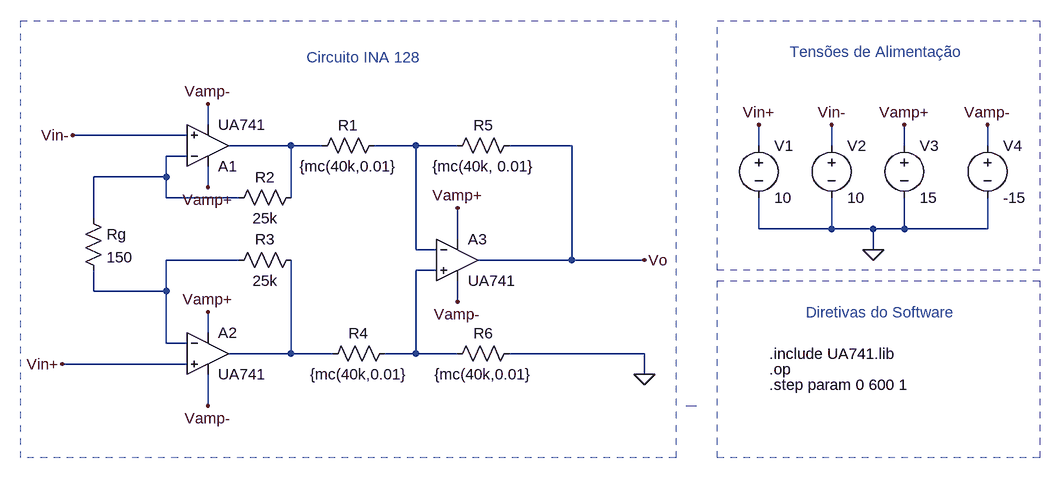
[diagram p0: schematic Trabalho1_Simu_2B001.asc]
Trabalho1_Simu_2B001.asc, the LTspice schematic file:
Version 4
SHEET 1 1748 680
WIRE -224 -176 -224 -208
WIRE -256 -160 -432 -160
WIRE -96 -144 -192 -144
WIRE -48 -144 -96 -144
WIRE 96 -144 32 -144
WIRE 160 -144 96 -144
WIRE 336 -144 240 -144
WIRE 624 -144 624 -176
WIRE 736 -144 736 -176
WIRE 848 -144 848 -176
WIRE 976 -144 976 -176
WIRE -256 -128 -288 -128
WIRE -288 -96 -288 -128
WIRE -288 -96 -400 -96
WIRE -224 -80 -224 -112
WIRE -288 -64 -288 -96
WIRE -176 -64 -288 -64
WIRE -96 -64 -96 -144
WIRE -400 -32 -400 -96
WIRE 624 -16 624 -64
WIRE 736 -16 736 -64
WIRE 736 -16 624 -16
WIRE 800 -16 736 -16
WIRE 848 -16 848 -64
WIRE 848 -16 800 -16
WIRE 976 -16 976 -64
WIRE 976 -16 848 -16
WIRE 160 0 160 -48
WIRE 96 16 96 -144
WIRE 128 16 96 16
WIRE 800 16 800 -16
WIRE -176 32 -288 32
WIRE 336 32 336 -144
WIRE 336 32 192 32
WIRE 448 32 336 32
WIRE 128 48 96 48
WIRE -400 80 -400 48
WIRE -288 80 -288 32
WIRE -288 80 -400 80
WIRE 160 96 160 64
WIRE -224 144 -224 112
WIRE -288 160 -288 80
WIRE -256 160 -288 160
WIRE -96 176 -96 32
WIRE -96 176 -192 176
WIRE -32 176 -96 176
WIRE 96 176 96 48
WIRE 96 176 48 176
WIRE 160 176 96 176
WIRE 448 176 240 176
WIRE -256 192 -448 192
WIRE 448 208 448 176
WIRE -224 256 -224 208
FLAG 448 32 Vo
FLAG 624 -176 Vin+
FLAG 736 -176 Vin-
FLAG 848 -176 Vamp+
FLAG 976 -176 Vamp-
FLAG 800 16 0
FLAG -448 192 Vin+
FLAG -432 -160 Vin-
FLAG 448 208 0
FLAG 160 -48 Vamp+
FLAG -224 -80 Vamp+
FLAG -224 112 Vamp+
FLAG -224 -208 Vamp-
FLAG 160 96 Vamp-
FLAG -224 256 Vamp-
SYMBOL res 48 -160 R90
WINDOW 0 0 56 VBottom 2
WINDOW 3 32 56 VTop 2
SYMATTR InstName R1
SYMATTR Value {mc(40k,0.01}
SYMBOL res -80 -80 R90
WINDOW 0 0 56 VBottom 2
WINDOW 3 32 56 VTop 2
SYMATTR InstName R2
SYMATTR Value 25k
SYMBOL res -80 16 R90
WINDOW 0 0 56 VBottom 2
WINDOW 3 32 56 VTop 2
SYMATTR InstName R3
SYMATTR Value 25k
SYMBOL res 64 160 R90
WINDOW 0 0 56 VBottom 2
WINDOW 3 32 56 VTop 2
SYMATTR InstName R4
SYMATTR Value {mc(40k,0.01}
SYMBOL res 256 -160 R90
WINDOW 0 0 56 VBottom 2
WINDOW 3 32 56 VTop 2
SYMATTR InstName R5
SYMATTR Value {mc(40k, 0.01}
SYMBOL res 256 160 R90
WINDOW 0 0 56 VBottom 2
WINDOW 3 32 56 VTop 2
SYMATTR InstName R6
SYMATTR Value {mc(40k,0.01}
SYMBOL res -416 -48 R0
SYMATTR InstName Rg
SYMATTR Value 150
SYMBOL OpAmps\\opamp2 -224 112 R0
SYMATTR InstName A2
SYMATTR Value UA741
SYMBOL OpAmps\\opamp2 160 -32 R0
SYMATTR InstName A3
SYMATTR Value UA741
SYMBOL OpAmps\\opamp2 -224 -80 M180
SYMATTR InstName A1
SYMATTR Value UA741
SYMBOL voltage 624 -160 R0
WINDOW 123 0 0 Left 0
WINDOW 39 0 0 Left 0
SYMATTR InstName V1
SYMATTR Value 10
SYMBOL voltage 736 -160 R0
WINDOW 123 0 0 Left 0
WINDOW 39 0 0 Left 0
SYMATTR InstName V2
SYMATTR Value 10
SYMBOL voltage 848 -160 R0
WINDOW 123 0 0 Left 0
WINDOW 39 0 0 Left 0
SYMATTR InstName V3
SYMATTR Value 15
SYMBOL voltage 976 -160 R0
WINDOW 123 0 0 Left 0
WINDOW 39 0 0 Left 0
SYMATTR InstName V4
SYMATTR Value -15
TEXT 672 -288 Left 2 ;Tensões de Alimentação
TEXT -72 -280 Left 2 ;Circuito INA 128
TEXT 696 112 Left 2 ;Diretivas do Software
TEXT 640 200 Left 2 !.op
TEXT 640 176 Left 2 !.include UA741.lib
TEXT 640 224 Left 2 !.step param 0 600 1
LINE Normal 528 256 528 256 2
LINE Normal 512 256 528 256 2
RECTANGLE Normal 1056 48 560 -336 2
RECTANGLE Normal 496 336 -512 -336 2
RECTANGLE Normal 1056 336 560 64 2

The netlist it stands for:
* Trabalho1_Simu_2B001.asc
R1 N002 N001 {mc(40k,0.01}
R2 N001 N003 25k
R3 N006 N004 25k
R4 N005 N006 {mc(40k,0.01}
R5 Vo N002 {mc(40k, 0.01}
R6 0 N005 {mc(40k,0.01}
Rg N003 N004 150
XA2 Vin+ N004 Vamp+ Vamp- N006 UA741  ; pins In+ In- V+ V- OUT
XA3 N005 N002 Vamp+ Vamp- Vo UA741  ; pins In+ In- V+ V- OUT
XA1 Vin- N003 Vamp+ Vamp- N001 UA741  ; pins In+ In- V+ V- OUT
V1 Vin+ 0 10
V2 Vin- 0 10
V3 Vamp+ 0 15
V4 Vamp- 0 -15
* Tensões de Alimentação
* Circuito INA 128
* Diretivas do Software
.op
.include UA741.lib
.step param 0 600 1
.backanno
.end

* Results of the author's LTspice run, read from the files saved beside the schematic
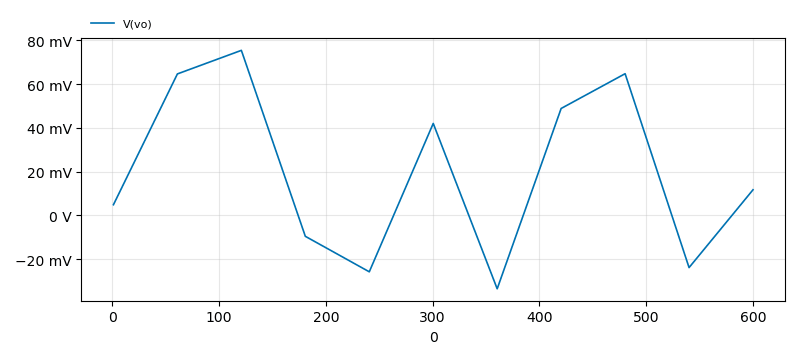
[diagram p1: Operating Point of Trabalho1_Simu_2B001.asc, plotted from the saved traces]
* Operating Point, 1 run:
*   V(vo): 4.867 mV at 0=1 , 11.7 mV at 0=600 , min -33.54 mV, max 75.38 mV
* From the log:
*   Semiconductor Device Operating Points:
*                           --- Diodes ---
*   Name:    d:a1:p      d:a1:ln     d:a1:lp     d:a1:e      d:a1:c
*   Model:    a1:dx       a1:dx       a1:dx       a1:dx       a1:dx
*   Id:     -3.00e-11   -2.51e-11   -2.49e-11   -2.24e-11   -2.40e-12
*   Vd:     -3.00e+01   -2.51e+01   -2.49e+01   -2.24e+01   -2.40e+00
*   Req:     1.00e+12    1.00e+12    1.00e+12    1.00e+12    1.00e+12
*   CAP:     0.00e+00    0.00e+00    0.00e+00    0.00e+00    0.00e+00
*   Name:    d:a3:p      d:a3:ln     d:a3:lp     d:a3:e      d:a3:c
*   Model:    a3:dx       a3:dx       a3:dx       a3:dx       a3:dx
*   Id:     -3.00e-11   -2.49e-11   -2.51e-11   -1.24e-11   -1.24e-11
*   Vd:     -3.00e+01   -2.49e+01   -2.51e+01   -1.24e+01   -1.24e+01
*   Req:     1.00e+12    1.00e+12    1.00e+12    1.00e+12    1.00e+12
*   CAP:     0.00e+00    0.00e+00    0.00e+00    0.00e+00    0.00e+00
*   Name:    d:a2:p      d:a2:ln     d:a2:lp     d:a2:e      d:a2:c
*   Model:    a2:dx       a2:dx       a2:dx       a2:dx       a2:dx
*   Id:     -3.00e-11   -2.51e-11   -2.49e-11   -2.24e-11   -2.40e-12
*   Vd:     -3.00e+01   -2.51e+01   -2.49e+01   -2.24e+01   -2.40e+00
*   Req:     1.00e+12    1.00e+12    1.00e+12    1.00e+12    1.00e+12
*   CAP:     0.00e+00    0.00e+00    0.00e+00    0.00e+00    0.00e+00
*                           --- Bipolar Transistors ---
*   Name:     q:a1:2      q:a1:1      q:a3:2      q:a3:1      q:a2:2
*   Model:     a1:qx       a1:qx       a3:qx       a3:qx       a2:qx
*   Ib:       8.40e-08    8.35e-08    8.18e-08    8.17e-08    8.40e-08
*   Ic:       5.25e-06    5.22e-06    5.12e-06    5.11e-06    5.25e-06
*   Vbe:      5.85e-01    5.85e-01    5.84e-01    5.84e-01    5.85e-01
*   Vbc:     -4.96e+00   -4.96e+00   -9.95e+00   -9.95e+00   -4.96e+00
*   Vce:      5.54e+00    5.54e+00    1.05e+01    1.05e+01    5.54e+00
*   BetaDC:   6.25e+01    6.25e+01    6.25e+01    6.25e+01    6.25e+01
*   Gm:       2.03e-04    2.02e-04    1.98e-04    1.97e-04    2.03e-04
*   Rpi:      3.08e+05    3.10e+05    3.16e+05    3.17e+05    3.08e+05
*   Rx:       0.00e+00    0.00e+00    0.00e+00    0.00e+00    0.00e+00
*   Ro:       5.79e+96    5.89e+96    0.00e+00    0.00e+00    5.79e+96
*   Cbe:      0.00e+00    0.00e+00    0.00e+00    0.00e+00    0.00e+00
*   Cbc:      0.00e+00    0.00e+00    0.00e+00    0.00e+00    0.00e+00
*   Cjs:      0.00e+00    0.00e+00    0.00e+00    0.00e+00    0.00e+00
*   BetaAC:   6.25e+01    6.25e+01    6.25e+01    6.25e+01    6.25e+01
*   Cbx:      0.00e+00    0.00e+00    0.00e+00    0.00e+00    0.00e+00
*   Ft:       0.00e+00    0.00e+00    0.00e+00    0.00e+00    0.00e+00
*   Name:     q:a2:1
*   Model:     a2:qx
*   Ib:       8.35e-08
*   Ic:       5.22e-06
*   Vbe:      5.85e-01
*   Vbc:     -4.96e+00
*   Vce:      5.54e+00
*   BetaDC:   6.25e+01
*   Gm:       2.02e-04
*   Rpi:      3.10e+05
*   Rx:       0.00e+00
*   Ro:       5.89e+96
*   Cbe:      0.00e+00
*   Cbc:      0.00e+00
*   Cjs:      0.00e+00
*   BetaAC:   6.25e+01
*   Cbx:      0.00e+00
*   Ft:       0.00e+00